# EAGLE schematic Adc (EAGLE 6.2)
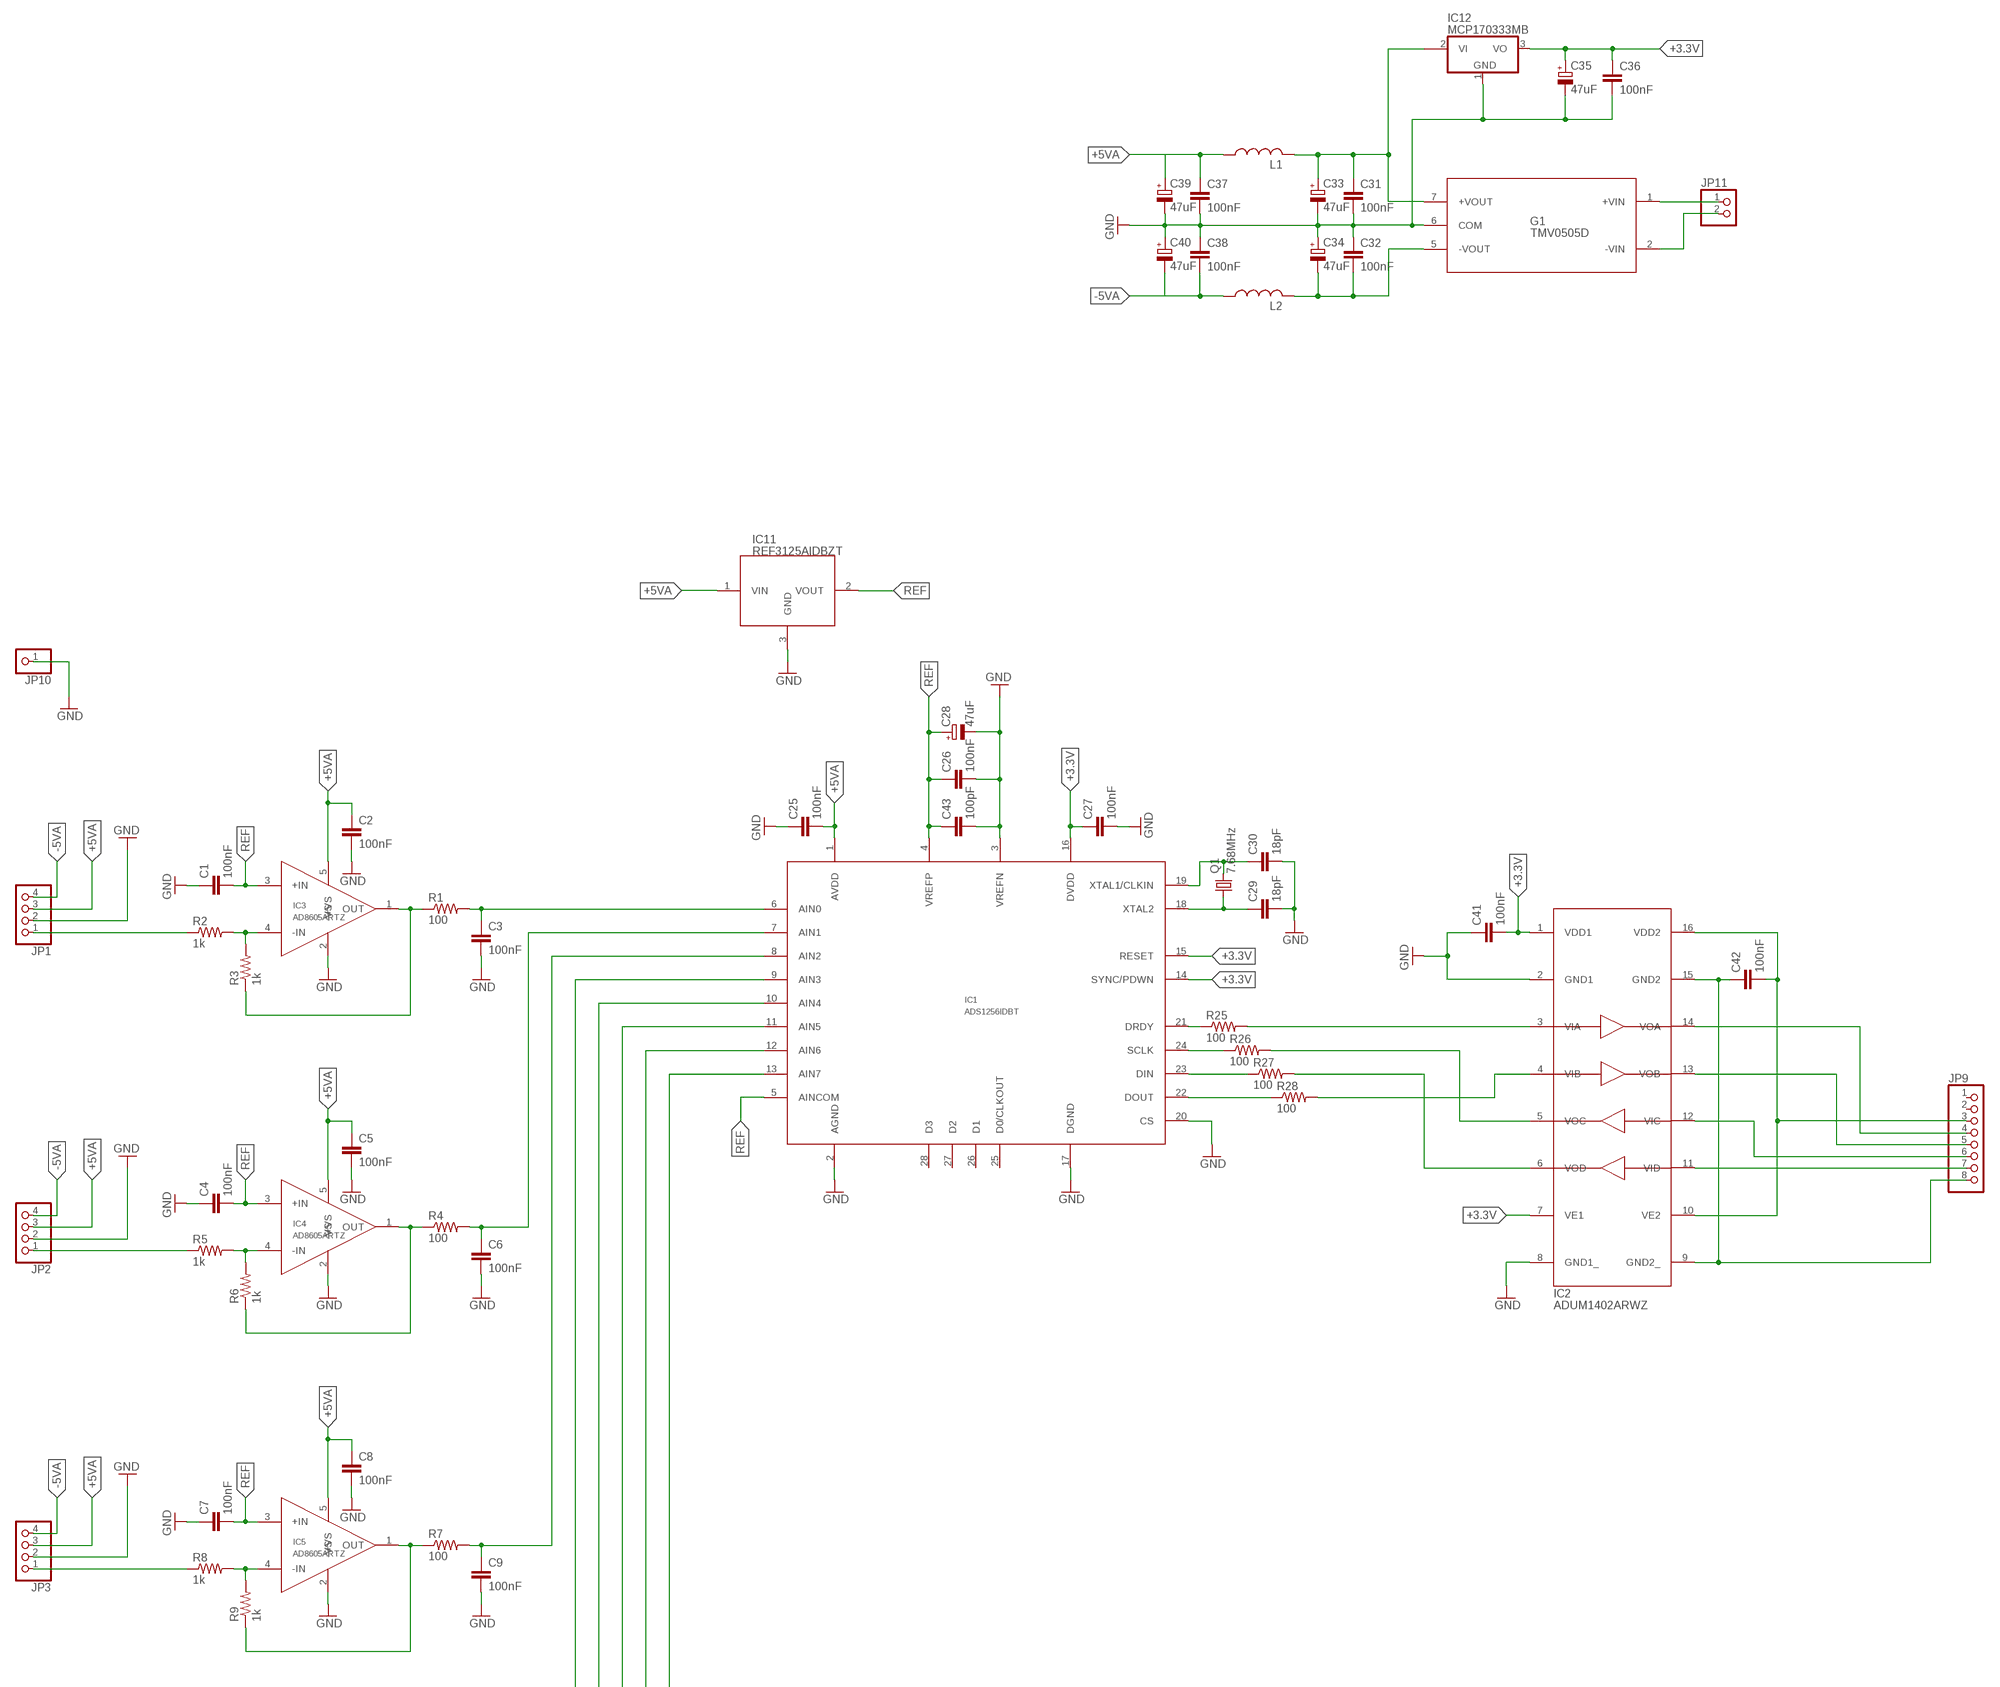
[diagram p0: schematic, sheet 1, part 1 of 2]
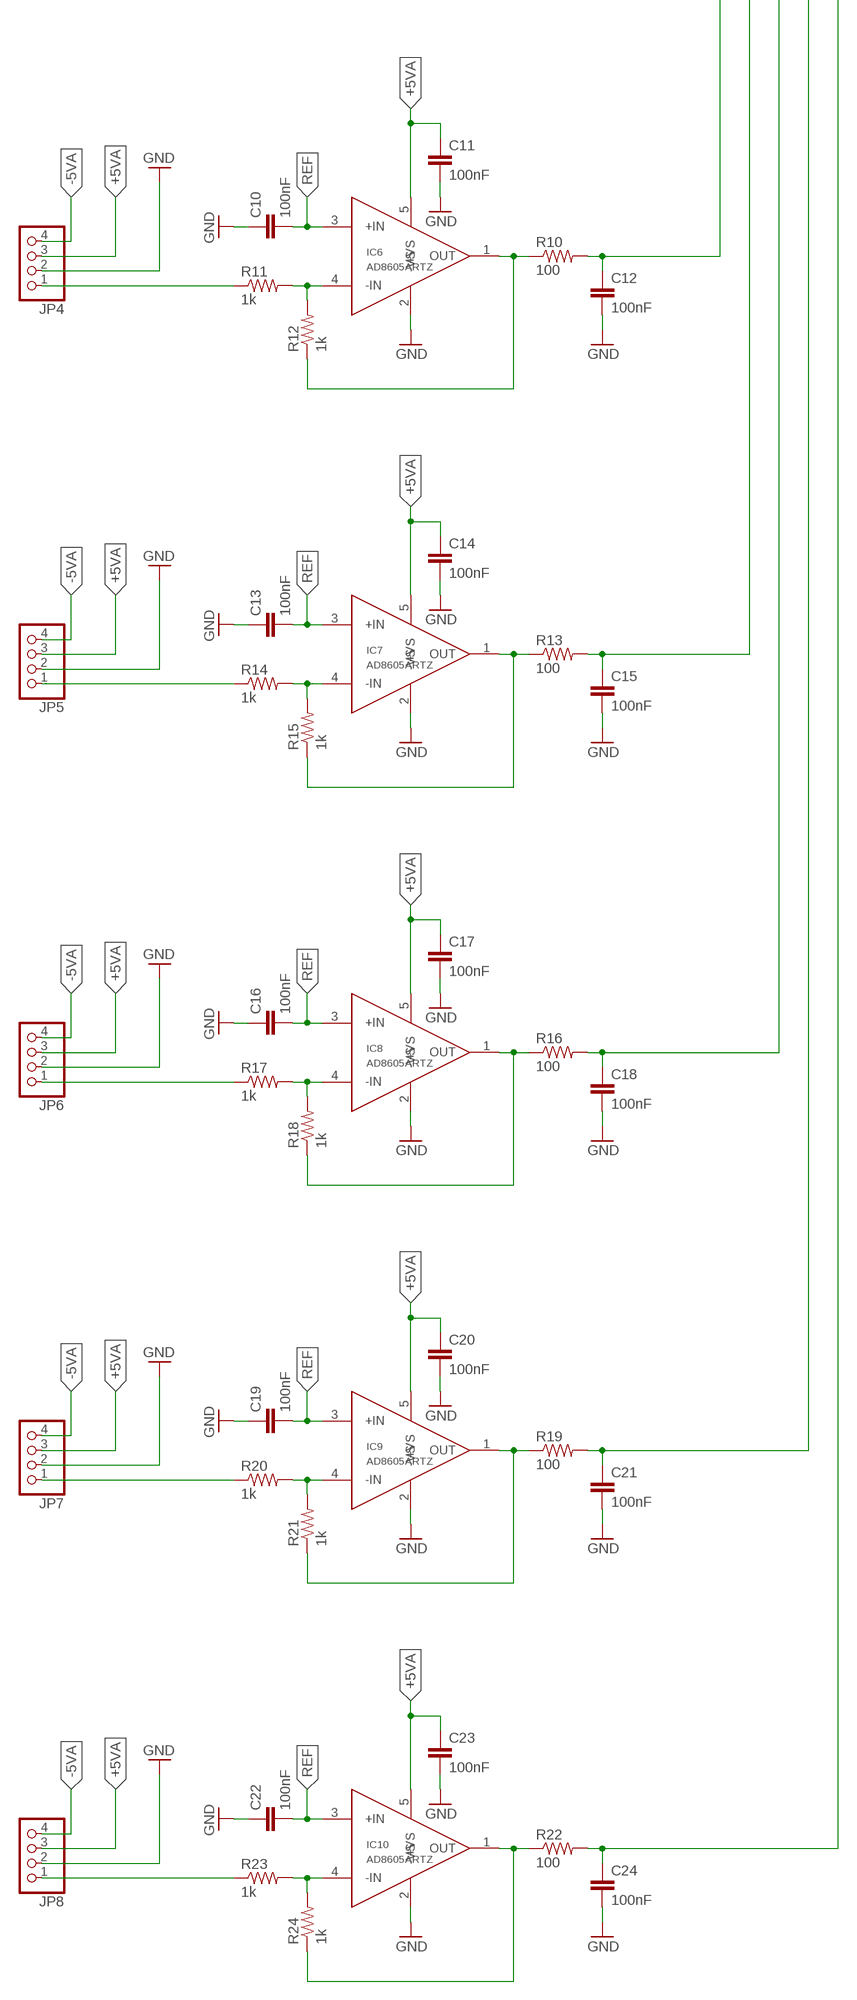
[diagram p1: schematic, sheet 1, part 2 of 2]

## Parts
C1  100nF  CAP0805  [0805]
C2  100nF  CAP0805  [0805]
C3  100nF  CAP0805  [0805]
C4  100nF  CAP0805  [0805]
C5  100nF  CAP0805  [0805]
C6  100nF  CAP0805  [0805]
C7  100nF  CAP0805  [0805]
C8  100nF  CAP0805  [0805]
C9  100nF  CAP0805  [0805]
C10  100nF  CAP0805  [0805]
C11  100nF  CAP0805  [0805]
C12  100nF  CAP0805  [0805]
C13  100nF  CAP0805  [0805]
C14  100nF  CAP0805  [0805]
C15  100nF  CAP0805  [0805]
C16  100nF  CAP0805  [0805]
C17  100nF  CAP0805  [0805]
C18  100nF  CAP0805  [0805]
C19  100nF  CAP0805  [0805]
C20  100nF  CAP0805  [0805]
C21  100nF  CAP0805  [0805]
C22  100nF  CAP0805  [0805]
C23  100nF  CAP0805  [0805]
C24  100nF  CAP0805  [0805]
C25  100nF  CAP0805  [0805]
C26  100nF  CAP0805  [0805]
C27  100nF  CAP0805  [0805]
C28  47uF  CPOL-EUE2-4  [E2-4]
C29  18pF  CAP0805  [0805]
C30  18pF  CAP0805  [0805]
C31  100nF  CAP0805  [0805]
C32  100nF  CAP0805  [0805]
C33  47uF  CPOL-EUE2-4  [E2-4]
C34  47uF  CPOL-EUE2-4  [E2-4]
C35  47uF  CPOL-EUE2-4  [E2-4]
C36  100nF  CAP0805  [0805]
C37  100nF  CAP0805  [0805]
C38  100nF  CAP0805  [0805]
C39  47uF  CPOL-EUE2-4  [E2-4]
C40  47uF  CPOL-EUE2-4  [E2-4]
C41  100nF  CAP0805  [0805]
C42  100nF  CAP0805  [0805]
C43  100pF  CAP0805  [0805]
G1  TMV0505D  [TMV0505D]
IC1  ADS1256IDBT  [ADS1256IDBT]
IC2  ADUM1402ARWZ  [ADUM1402ARWZ]
IC3  AD8605ARTZ  [AD8605ARTZ]
IC4  AD8605ARTZ  [AD8605ARTZ]
IC5  AD8605ARTZ  [AD8605ARTZ]
IC6  AD8605ARTZ  [AD8605ARTZ]
IC7  AD8605ARTZ  [AD8605ARTZ]
IC8  AD8605ARTZ  [AD8605ARTZ]
IC9  AD8605ARTZ  [AD8605ARTZ]
IC10  AD8605ARTZ  [AD8605ARTZ]
IC11  REF3125AIDBZT  [REF3125AIDBZT]
IC12  MCP170333MB  [SOT89]
JP1  PINHD-1X4  [1X04]
JP2  PINHD-1X4  [1X04]
JP3  PINHD-1X4  [1X04]
JP4  PINHD-1X4  [1X04]
JP5  PINHD-1X4  [1X04]
JP6  PINHD-1X4  [1X04]
JP7  PINHD-1X4  [1X04]
JP8  PINHD-1X4  [1X04]
JP9  PINHD-1X8  [1X08]
JP10  PINHD-1X1  [1X01]
JP11  PINHD-1X2  [1X02]
L1  L-USL4532P  [L4532P]
L2  L-USL4532P  [L4532P]
Q1  7.68MHz  CRYSTALHC49U-V  [HC49U-V]
R1  100  RESISTOR0805-RES  [0805]
R2  1k  RESISTOR0805-RES  [0805]
R3  1k  RESISTOR0805-RES  [0805]
R4  100  RESISTOR0805-RES  [0805]
R5  1k  RESISTOR0805-RES  [0805]
R6  1k  RESISTOR0805-RES  [0805]
R7  100  RESISTOR0805-RES  [0805]
R8  1k  RESISTOR0805-RES  [0805]
R9  1k  RESISTOR0805-RES  [0805]
R10  100  RESISTOR0805-RES  [0805]
R11  1k  RESISTOR0805-RES  [0805]
R12  1k  RESISTOR0805-RES  [0805]
R13  100  RESISTOR0805-RES  [0805]
R14  1k  RESISTOR0805-RES  [0805]
R15  1k  RESISTOR0805-RES  [0805]
R16  100  RESISTOR0805-RES  [0805]
R17  1k  RESISTOR0805-RES  [0805]
R18  1k  RESISTOR0805-RES  [0805]
R19  100  RESISTOR0805-RES  [0805]
R20  1k  RESISTOR0805-RES  [0805]
R21  1k  RESISTOR0805-RES  [0805]
R22  100  RESISTOR0805-RES  [0805]
R23  1k  RESISTOR0805-RES  [0805]
R24  1k  RESISTOR0805-RES  [0805]
R25  100  RESISTOR0805-RES  [0805]
R26  100  RESISTOR0805-RES  [0805]
R27  100  RESISTOR0805-RES  [0805]
R28  100  RESISTOR0805-RES  [0805]

## Nets
+3.3V: C27.1 C35.+ C36.1 C41.2 IC1.14(SYNC/PDWN) IC1.15(RESET) IC1.16(DVDD) IC2.1(VDD1) IC2.7(VE1) IC12.3(VO)
+5VA: C2.1 C5.1 C8.1 C11.1 C14.1 C17.1 C20.1 C23.1 C25.2 C37.1 C39.+ IC1.1(AVDD) IC3.5(+VS) IC4.5(+VS) IC5.5(+VS) IC6.5(+VS) IC7.5(+VS) IC8.5(+VS) IC9.5(+VS) IC10.5(+VS) IC11.1(VIN) JP1.3 JP2.3 JP3.3 JP4.3 JP5.3 JP6.3 JP7.3 JP8.3 L1.1
-5VA: C38.2 C40.- JP1.4 JP2.4 JP3.4 JP4.4 JP5.4 JP6.4 JP7.4 JP8.4 L2.1
GND: C1.1 C2.2 C3.2 C4.1 C5.2 C6.2 C7.1 C8.2 C9.2 C10.1 C11.2 C12.2 C13.1 C14.2 C15.2 C16.1 C17.2 C18.2 C19.1 C20.2 C21.2 C22.1 C23.2 C24.2 C25.1 C26.2 C27.2 C28.- C29.2 C30.2 C31.2 C32.1 C33.- C34.+ C35.- C36.2 C37.2 C38.1 C39.- C40.+ C41.1 C43.2 G1.6(COM) IC1.2(AGND) IC1.3(VREFN) IC1.17(DGND) IC1.20(CS) IC2.2(GND1) IC2.8(GND1_) IC3.2(-VS) IC4.2(-VS) IC5.2(-VS) IC6.2(-VS) IC7.2(-VS) IC8.2(-VS) IC9.2(-VS) IC10.2(-VS) IC11.3(GND) IC12.1(GND) JP1.2 JP2.2 JP3.2 JP4.2 JP5.2 JP6.2 JP7.2 JP8.2 JP10.1
N$1: IC3.4(-IN) R2.2 R3.2
N$2: IC3.1(OUT) R1.1 R3.1
N$3: JP1.1 R2.1
N$4: C3.1 IC1.6(AIN0) R1.2
N$5: IC4.4(-IN) R5.2 R6.2
N$6: IC4.1(OUT) R4.1 R6.1
N$7: C6.1 IC1.7(AIN1) R4.2
N$8: JP2.1 R5.1
N$9: IC5.4(-IN) R8.2 R9.2
N$10: IC5.1(OUT) R7.1 R9.1
N$11: C9.1 IC1.8(AIN2) R7.2
N$12: JP3.1 R8.1
N$13: IC6.4(-IN) R11.2 R12.2
N$14: IC6.1(OUT) R10.1 R12.1
N$15: C12.1 IC1.9(AIN3) R10.2
N$16: JP4.1 R11.1
N$17: IC7.4(-IN) R14.2 R15.2
N$18: IC7.1(OUT) R13.1 R15.1
N$19: C15.1 IC1.10(AIN4) R13.2
N$20: JP5.1 R14.1
N$21: IC8.4(-IN) R17.2 R18.2
N$22: IC8.1(OUT) R16.1 R18.1
N$23: C18.1 IC1.11(AIN5) R16.2
N$24: JP6.1 R17.1
N$25: IC9.4(-IN) R20.2 R21.2
N$26: IC9.1(OUT) R19.1 R21.1
N$27: C21.1 IC1.12(AIN6) R19.2
N$28: JP7.1 R20.1
N$29: IC10.4(-IN) R23.2 R24.2
N$30: IC10.1(OUT) R22.1 R24.1
N$31: C24.1 IC1.13(AIN7) R22.2
N$32: JP8.1 R23.1
N$33: C29.1 IC1.18(XTAL2) Q1.1
N$34: C30.1 IC1.19(XTAL1/CLKIN) Q1.2
N$35: IC2.11(VID) JP9.7
N$36: IC1.21(DRDY) R25.1
N$37: IC1.24(SCLK) R26.1
N$38: IC1.23(DIN) R27.1
N$39: IC1.22(DOUT) R28.1
N$40: C42.1 IC2.9(GND2_) IC2.15(GND2) JP9.8
N$41: C31.1 C33.+ G1.7(+VOUT) IC12.2@1(VI1) L1.2
N$42: C32.2 C34.- G1.5(-VOUT) L2.2
N$43: C42.2 IC2.10(VE2) IC2.16(VDD2) JP9.3
N$44: IC2.3(VIA) R25.2
N$45: IC2.4(VIB) R28.2
N$46: IC2.5(VOC) R26.2
N$47: IC2.6(VOD) R27.2
N$48: IC2.12(VIC) JP9.6
N$49: IC2.13(VOB) JP9.5
N$50: IC2.14(VOA) JP9.4
N$51: G1.1(+VIN) JP11.1
N$52: G1.2(-VIN) JP11.2
REF: C1.2 C4.2 C7.2 C10.2 C13.2 C16.2 C19.2 C22.2 C26.1 C28.+ C43.1 IC1.4(VREFP) IC1.5(AINCOM) IC3.3(+IN) IC4.3(+IN) IC5.3(+IN) IC6.3(+IN) IC7.3(+IN) IC8.3(+IN) IC9.3(+IN) IC10.3(+IN) IC11.2(VOUT)
Unconnected: IC1.25(D0/CLKOUT) IC1.26(D1) IC1.27(D2) IC1.28(D3) IC12.2(VI) JP9.1 JP9.2

## Library data of the parts
C1-C27 C29-C32 C36-C38 C41-C43 = SparkFun-Passives:CAP: Capacitor Standard 0603 ceramic capacitor, and 0.1" leaded capacitor.
C28 C33-C35 C39 C40 = rcl:CPOL-EU: POLARIZED CAPACITOR, European symbol
G1 = femtoexg:TMV0505D
IC1 = femtoexg:ADS1256IDBT
IC2 = femtoexg:ADUM1402ARWZ
IC3-IC10 = femtoexg:AD8605ARTZ
IC11 = femtoexg:REF3125AIDBZT
IC12 = linear:MCP1703*: 250 mA, 16V, Low Quiescent Current LDO Regulator Source: http://ww1.microchip.com/downloads/en/DeviceDoc/22049b.pdf
JP1-JP8 = pinhead:PINHD-1X4: PIN HEADER
JP9 = pinhead:PINHD-1X8: PIN HEADER
JP10 = pinhead:PINHD-1X1: PIN HEADER
JP11 = pinhead:PINHD-1X2: PIN HEADER
L1 L2 = rcl:L-US: INDUCTOR, American symbol
Q1 = crystal:CRYSTAL: CRYSTAL; OC_FARNELL: 1666969; OC_NEWARK: unknown
R1-R28 = SparkFun-Passives:RESISTOR: Resistor Basic schematic elements and footprints for 0603, 1206, and PTH resistors.